# Altium schematic sheet [15] - POWER IN.SchDoc
size A3; DocumentNumber: 15; SheetNumber: 15; SheetTotal: 18
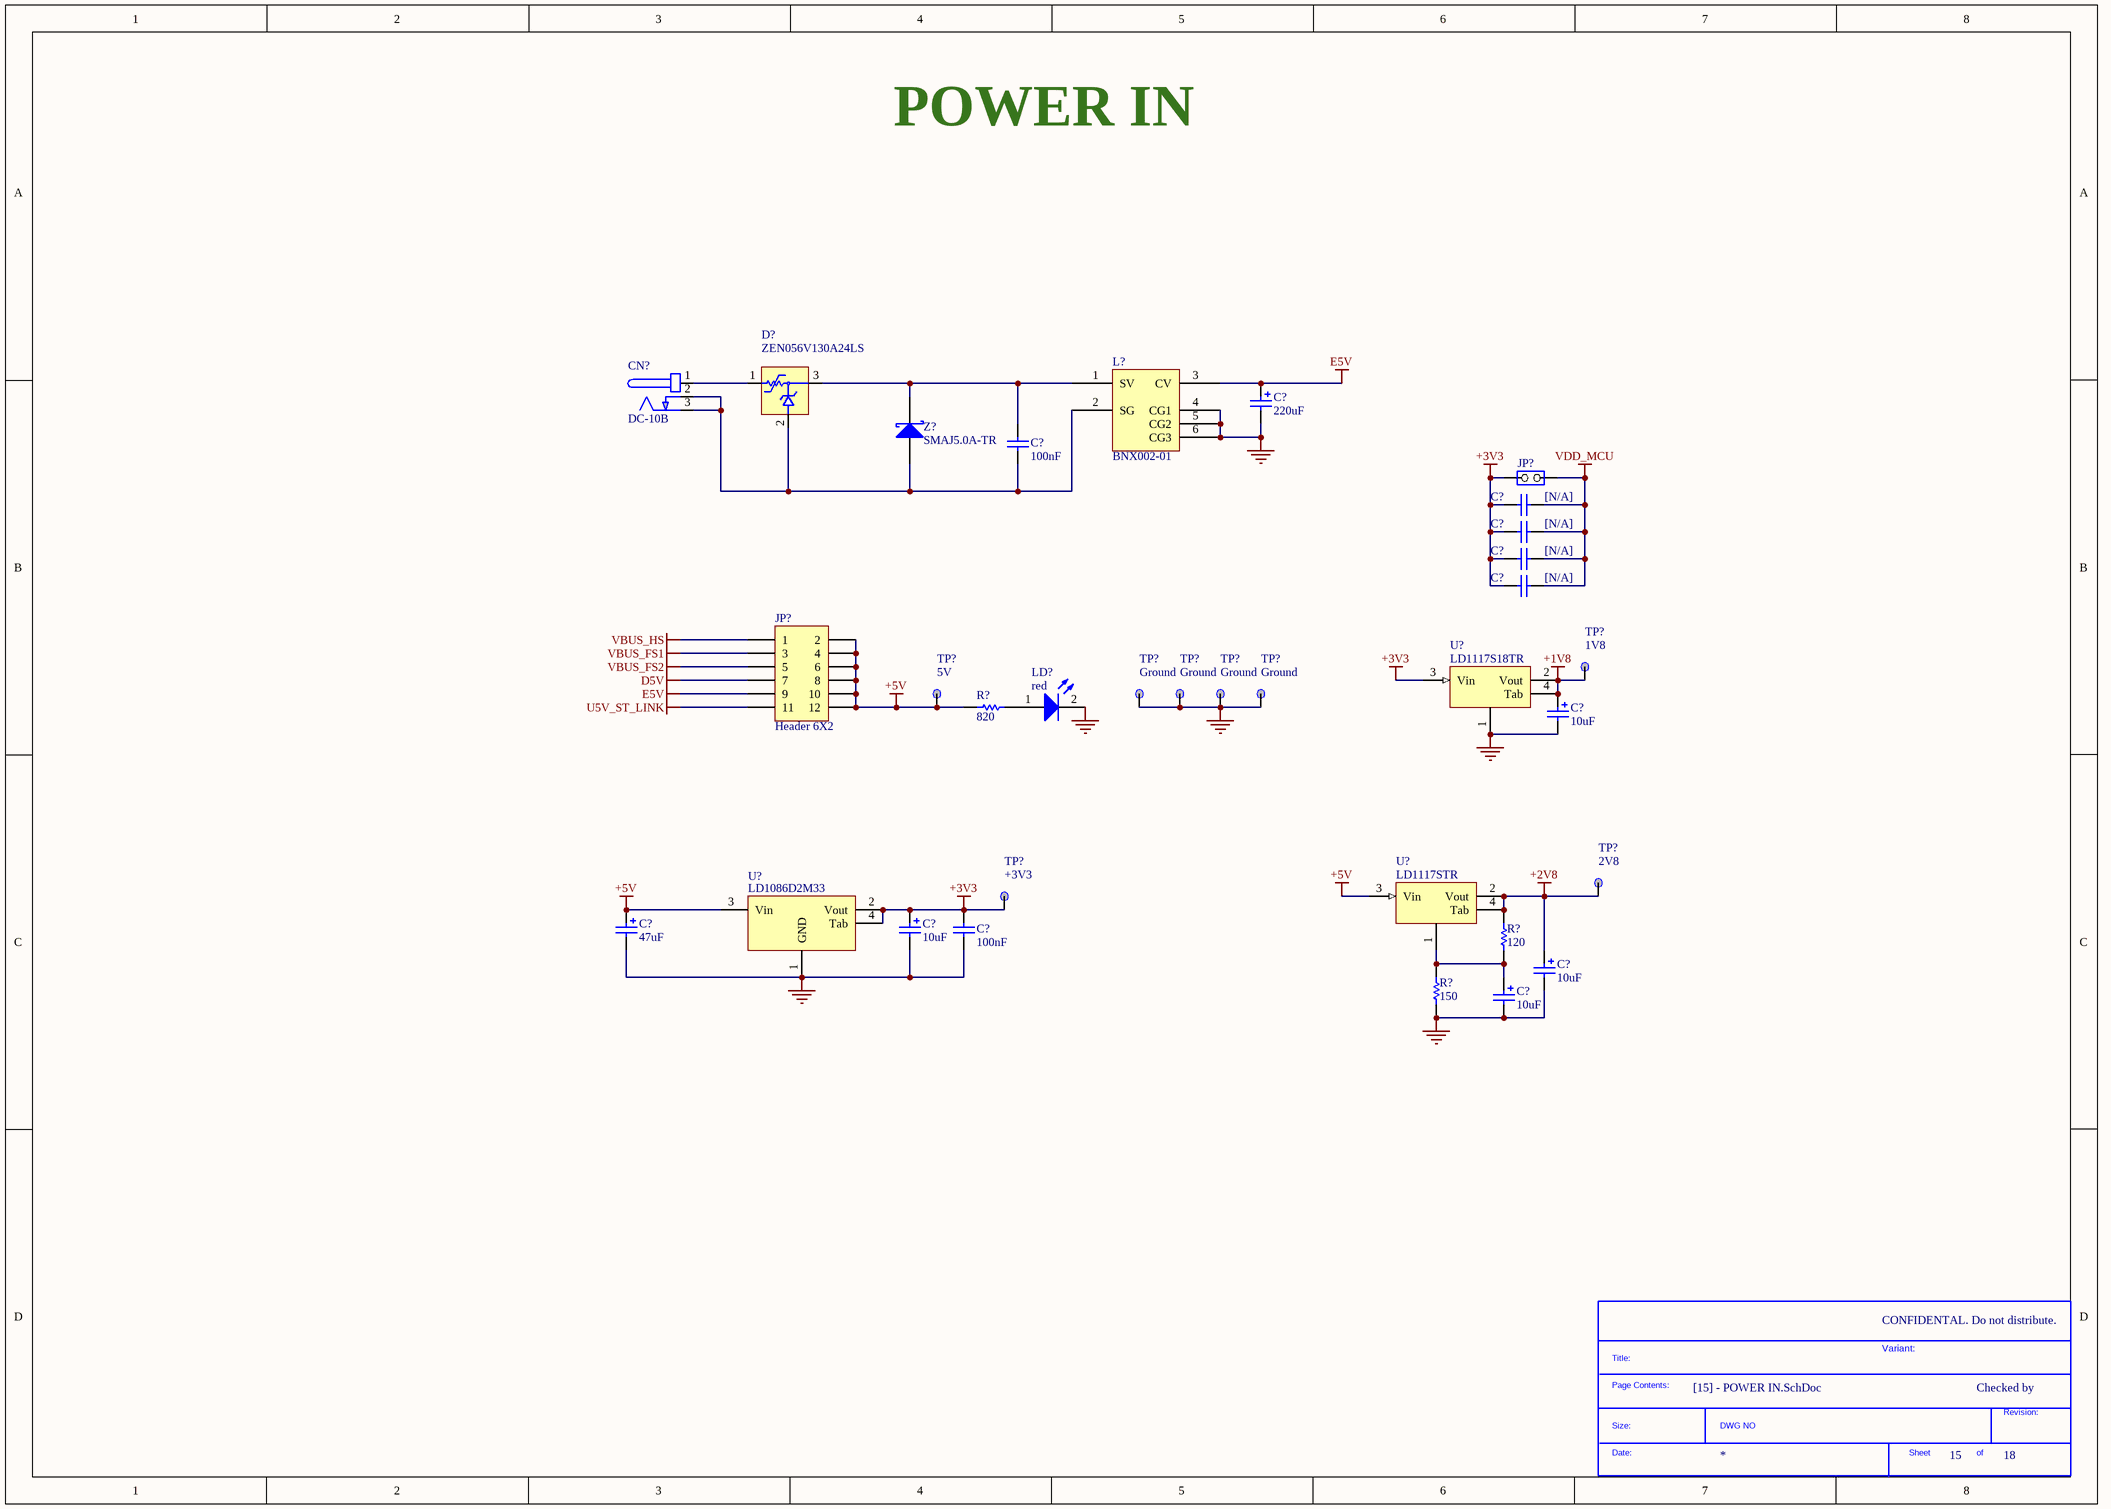
[diagram p0: [15] - POWER IN.SchDoc]

## Parts
(Parts that share a designator on the sheet are numbered #1, #2 ... from top to bottom, then left to right.)
*  SDTitleBlock  (value not drawn)  (graphical)
C?#1  220uF  [c310m-6]
C?#2  100nF  [0603C]
C?#3  [N/A]  [0603C]
C?#4  [N/A]  [0603C]
C?#5  [N/A]  [0603C]
C?#6  [N/A]  [0603C]
C?#7  10uF  [TAN-A]
C?#8  47uF  [CAE_5R3X5R3_H5R4]
C?#9  10uF  [TAN-A]
C?#10  100nF  [0603C]
C?#11  10uF  [TAN-A]
C?#12  10uF  [TAN-A]
CN?  DC-10B  [PWR_JACK_DC10]
D?  ZEN056V130A24LS  [TYCO_ZEN056V130A24LS]
JP?#1  (no value)  [SIP2]
JP?#2  Header 6X2  [HDR_2X6_2R54]
L?  BNX002-01  [BNX001]
LD?  red  [0603D]
R?#1  820  [0603R]
R?#2  120  [0603R]
R?#3  150  [0603R]
TP?#1  1V8  [TP]
TP?#2  5V  [TP]
TP?#3  Ground  [TP]
TP?#4  Ground  [TP]
TP?#5  Ground  [TP]
TP?#6  Ground  [TP]
TP?#7  2V8  [TP]
TP?#8  +3V3  [TP]
U?#1  LD1117S18TR  [SOT-223]
U?#2  LD1086D2M33  [TO263-3]
U?#3  LD1117STR  [SOT-223]
Z?  SMAJ5.0A-TR  [sma]

## Nets
+1V8: C?#7.1 TP?#1.1 U?#1.2(Vout) U?#1.4(Tab)
+2V8: C?#11.1 R?#2.1 TP?#7.1 U?#3.2(Vout) U?#3.4(Tab)
+3V3: C?#3.1 C?#4.1 C?#5.1 C?#6.1 C?#9.1 C?#10.1 JP?#1.1(COMMON) TP?#8.1 U?#1.3(Vin) U?#2.2(Vout) U?#2.4(Tab)
+5V: C?#8.1 JP?#2.2 JP?#2.4 JP?#2.6 JP?#2.8 JP?#2.10 JP?#2.12 R?#1.2 TP?#2.1 U?#2.3(Vin) U?#3.3(Vin)
D5V: JP?#2.7
E5V: C?#1.1 JP?#2.9 L?.3(CV)
GND: C?#1.2 C?#7.2 C?#8.2 C?#9.2 C?#10.2 C?#11.2 C?#12.2 L?.4(CG1) L?.5(CG2) L?.6(CG3) LD?.2(K) R?#3.2 TP?#3.1 TP?#4.1 TP?#5.1 TP?#6.1 U?#1.1 U?#2.1(GND)
U5V_ST_LINK: JP?#2.11
VBUS_FS1: JP?#2.3
VBUS_FS2: JP?#2.5
VBUS_HS: JP?#2.1
VDD_MCU: C?#3.2 C?#4.2 C?#5.2 C?#6.2 JP?#1.2(NO)
NetC?#2_1: C?#2.1 D?.3 L?.1(SV) Z?.2(K)
NetC?#2_2: C?#2.2 CN?.2(GND) CN?.3(GND) D?.2 L?.2(SG) Z?.1(A)
NetC?#12_1: C?#12.1 R?#2.2 R?#3.1 U?#3.1
NetCN?_1: CN?.1(+) D?.1
NetLD?_1: LD?.1(A) R?#1.1

## Notes on the sheet
- POWER IN
- CONFIDENTAL. Do not distribute.
- CLOCKS (CPU & PCIE)
- Variant:
- Checked by
- (in symbol SDTitleBlock) Title:; Page Contents:; Revision:; Size:; DWG NO; Date:; Sheet; of

## Library data of the parts
C?#1 = Cap Pol1: Polarized Capacitor (Radial); Value: 47uF; Published: 8-Jun-2000; Revision: July-2002: Re-released for DXP Platform.; Publisher: Altium Limited
C?#2 = CAP: Capacitor; Value: 100pF; Published: 8-Jun-2000; Revision: July-2002: Re-released for DXP Platform.; Publisher: Altium Limited
C?#3-C?#6 C?#10 = Cap: Capacitor; Value: 10nF; Published: 8-Jun-2000; Revision: July-2002: Re-released for DXP Platform.; Publisher: Altium Limited
C?#7 C?#9 C?#11 C?#12 = Cap Pol1: Polarized Capacitor (Radial); Published: 8-Jun-2000; Revision: July-2002: Re-released for DXP Platform.; Publisher: Altium Limited; Value: 10uF
C?#8 = Cap Pol1: Polarized Capacitor (Radial); Value: 10uF; Published: 8-Jun-2000; Revision: July-2002: Re-released for DXP Platform.; Publisher: Altium Limited
CN? = PJ202A
JP?#1 = JP2
JP?#2 = Header 6X2: Header, 6-Pin, Dual row; Revision: 17-Jul-2002: Re-released for DXP Platform.; Publisher: Altium Limited
L? = BNX002
LD? = LED2: Typical RED, GREEN, YELLOW, AMBER GaAs LED; Published: 8-Jun-2000; Revision: July-2002: Re-released for DXP Platform.; Publisher: Altium Limited
R?#1-R?#3 = res1: Resistor; Value: 1K; Published: 8-Jun-2000; Revision: July-2002: Re-released for DXP Platform.; Publisher: Altium Limited
TP?#1-TP?#8 = TP
U?#1 U?#3 = LD1117
U?#2 = VOLTREG1
Z? = D Schottky: Schottky Diode; Code - JEDEC: DO-214-AA; Published: 8-Jun-2000; Revision: July-2002: Re-released for DXP Platform.; Publisher: Altium Limited